# Altium schematic sheet WS3.0.SchDoc
size A4
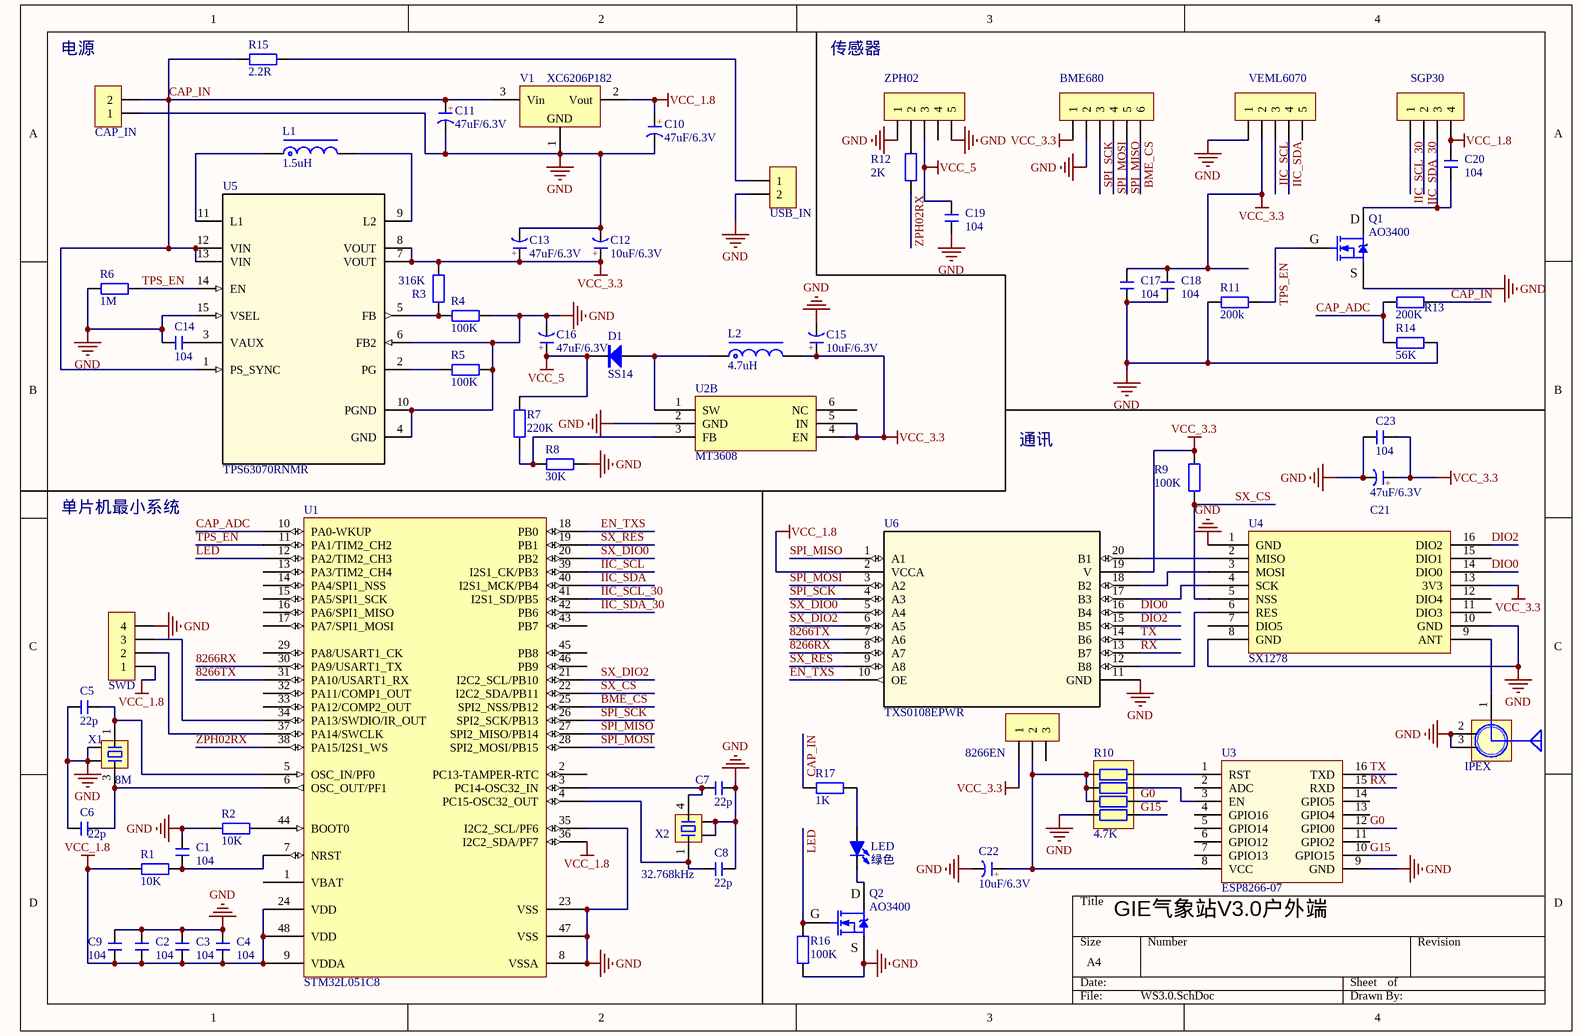
[diagram p0: WS3.0.SchDoc]

## Parts
8266EN  HDR-1X3  [HDR2.54-LI-3P]  (value not drawn)
?  IPEX  [IPEX]
BME680  HDR-1X6  [HDR2.54-LI-6P]  (value not drawn)
C1  104  [C 0603_L]
C2  104  [C 0603_L]
C3  104  [C 0603_L]
C4  104  [C 0603_L]
C5  22p  [C 0603_L]
C6  22p  [C 0603_L]
C7  22p  [C 0603_L]
C8  22p  [C 0603_L]
C9  104  [C 0603_L]
C10  47uF/6.3V  [CD A(3216)]
C11  47uF/6.3V  [CD A(3216)]
C12  10uF/6.3V  [CD S(2012)]
C13  47uF/6.3V  [CD A(3216)]
C14  104  [C 0603_L]
C15  10uF/6.3V  [CD S(2012)]
C16  47uF/6.3V  [CD A(3216)]
C17  104  [C 0603_L]
C18  104  [C 0603_L]
C19  104  [C 0603_L]
C20  104  [C 0603_L]
C21  47uF/6.3V  [CD A(3216)]
C22  10uF/6.3V  [CD S(2012)]
C23  104  [C 0603_L]
CAP_IN  HDR-1X2  [HDR2.54-LI-2P]  (value not drawn)
D1  SS14  [SOD-523]
L1  1.5uH  [NR4020]
L2  4.7uH  [L-SMD-0630]
LED  绿色  [LED 0805G]
Q1  AO3400  [SOT23-3N]
Q2  AO3400  [SOT23-3N]
R1  10K  [R 0603_L]
R2  10K  [R 0603_L]
R3  316K  [R 0603_L]
R4  100K  [R 0603_L]
R5  100K  [R 0603_L]
R6  1M  [R 0603_L]
R7  220K  [R 0603_L]
R8  30K  [R 0603_L]
R9  100K  [R 0603_L]
R10  4.7K  [RCA-8P4R-0603]
R11  200k  [R 0603_L]
R12  2K  [R 0603_L]
R13  200K  [R 0603_L]
R14  56K  [R 0603_L]
R15  2.2R  [RS 3W]
R16  100K  [R 0603_L]
R17  1K  [R 0603_L]
SGP30  HDR-1X4  [HDR2.54-LI-4P]  (value not drawn)
SWD  HDR-1X4  [HDR2.54-LI-4P]  (value not drawn)
U1  STM32L051C8  [LQFP48 7X7_M]
U2  MT3608  [SOT23-6L]  (part B of 2)
U3  ESP8266-07  [ESP-07]
U4  SX1278  [SX1278]
U5  TPS63070RNMR  [RNM0015A]
U6  TXS0108EPWR  [PW20]
USB_IN  HDR-1X2  [HDR2.54-LI-2P]  (value not drawn)
V1  XC6206P182  [SOT23-3M]
VEML6070  HDR-1X5  [HDR2.54-LI-5P]  (value not drawn)
X1  8M  [OSC 3225-4P]
X2  32.768kHz  [OSC MC-146]
ZPH02  HDR-1X5  [HDR2.54-LI-5P]  (value not drawn)

## Nets
GND: ?.2(GND) ?.3(GND) BME680.2 C1.2 C2.2 C3.2 C4.2 C5.1 C6.1 C7.2 C8.2 C9.2 C10.2(K) C11.2(K) C12.2(K) C13.2(K) C14.2 C15.2(K) C16.2(K) C17.1 C18.1 C19.1 C21.2(K) C22.2(K) C23.2 CAP_IN.1 Q1.2(S) Q2.2(S) R2.1 R4.2 R5.2 R6.1 R8.2 R10.4 R11.2 R14.1 R16.2 SWD.4 U1.8(VSSA) U1.23(VSS) U1.35(I2C2_SCL/PF6) U1.47(VSS) U2.2(GND) U3.9(GND) U4.1(GND) U4.8(GND) U4.10(GND) U5.4(GND) U5.6(FB2) U5.10(PGND) U5.15(VSEL) U6.11(GND) USB_IN.2 V1.1(GND) VEML6070.1 X1.2 X1.4 X2.2 X2.3 ZPH02.1 ZPH02.5
VCC_1.8: C2.1 C3.1 C4.1 C9.1 C10.1(A) C20.2 R1.1 SGP30.4 SWD.1 U1.9(VDDA) U1.24(VDD) U1.36(I2C2_SDA/PF7) U1.48(VDD) U6.2(VCCA) V1.2(Vout)
VCC_3.3: 8266EN.1 BME680.1 C12.1(A) C13.1(A) C15.1(A) C17.2 C18.2 C21.1(A) C23.1 L2.2 R3.2 R9.2 U2.4(EN) U2.5(IN) U4.13(3V3) U5.7(VOUT) U5.8(VOUT) U6.19(V) VEML6070.2
VCC_5: C16.1(A) C19.2 D1.2(K) R7.2 ZPH02.3
8266RX: U1.30(PA9/USART1_TX) U6.8(A7)
8266TX: U1.31(PA10/USART1_RX) U6.7(A6)
BME_CS: BME680.6 U1.25(SPI2_NSS/PB12)
CAP_ADC: R13.2 R14.2 U1.10(PA0-WKUP)
CAP_IN: C11.1(A) CAP_IN.2 R13.1 R15.1 R17.2 U5.1(PS_SYNC) U5.12(VIN) U5.13(VIN) V1.3(Vin)
DIO0: U4.14(DIO0) U6.16(B4)
DIO2: U4.16(DIO2) U6.15(B5)
EN_TXS: U1.18(PB0) U6.10(OE)
G0: R10.6 U3.12(GPIO0)
G15: R10.5 U3.10(GPIO15)
IIC_SCL: U1.39(I2S1_CK/PB3) VEML6070.3
IIC_SCL_30: SGP30.1 U1.41(I2S1_SD/PB5)
IIC_SDA: U1.40(I2S1_MCK/PB4) VEML6070.4
IIC_SDA_30: SGP30.2 U1.42(PB6)
LED: Q2.1(G) R16.1 U1.12(PA2/TIM2_CH3)
RX: U3.15(RXD) U6.13(B7)
SPI_MISO: BME680.5 U1.27(SPI2_MISO/PB14) U6.1(A1)
SPI_MOSI: BME680.4 U1.28(SPI2_MOSI/PB15) U6.3(A2)
SPI_SCK: BME680.3 U1.26(SPI2_SCK/PB13) U6.4(A3)
SX_CS: R9.1 U1.22(I2C2_SDA/PB11) U4.5(NSS)
SX_DIO0: U1.20(PB2) U6.5(A4)
SX_DIO2: U1.21(I2C2_SCL/PB10) U6.6(A5)
SX_RES: U1.19(PB1) U6.9(A8)
TPS_EN: Q1.1(G) R6.2 R11.1 U1.11(PA1/TIM2_CH2) U5.14(EN)
TX: U3.16(TXD) U6.14(B6)
ZPH02RX: R12.1 U1.38(PA15/I2S1_WS)
Net8266EN_2: 8266EN.2 C22.1(A) R10.1 R10.2 R10.3 U3.8(VCC)
Net?_1: ?.1(ANT) U4.9(ANT)
NetC1_1: C1.1 R1.2 U1.7(NRST)
NetC5_2: C5.2 U1.5(OSC_IN/PF0) X1.1
NetC6_2: C6.2 U1.6(OSC_OUT/PF1) X1.3
NetC7_1: C7.1 U1.3(PC14-OSC32_IN) X2.4
NetC8_1: C8.1 U1.4(PC15-OSC32_OUT) X2.1
NetC14_1: C14.1 U5.3(VAUX)
NetC20_1: C20.1 Q1.3(D) SGP30.3
NetD1_1: D1.1(A) L2.1 U2.1(SW)
NetL1_1: L1.1 U5.11(L1)
NetL1_2: L1.2 U5.9(L2)
NetLED_1: LED.1(A) R17.1
NetLED_2: LED.2(K) Q2.3(D)
NetR2_2: R2.2 U1.44(BOOT0)
NetR3_1: R3.1 R4.1 U5.5(FB)
NetR5_1: R5.1 U5.2(PG)
NetR7_1: R7.1 R8.1 U2.3(FB)
NetR10_7: R10.7 U3.3(EN)
NetR10_8: R10.8 U3.1(RST)
NetR12_2: R12.2 ZPH02.2
NetR15_2: R15.2 USB_IN.1
NetSWD_2: SWD.2 U1.37(PA14/SWCLK)
NetSWD_3: SWD.3 U1.34(PA13/SWDIO/IR_OUT)
NetU4_2: U4.2(MISO) U6.20(B1)
NetU4_3: U4.3(MOSI) U6.18(B2)
NetU4_4: U4.4(SCK) U6.17(B3)
NetU4_6: U4.6(RES) U6.12(B8)

Not connected (* = marked no-connect by the designer): 8266EN 3; U1 1(VBAT) 2(PC13-TAMPER-RTC) 13(PA3/TIM2_CH4) 14(PA4/SPI1_NSS) 15(PA5/SPI1_SCK) 16(PA6/SPI1_MISO) 17(PA7/SPI1_MOSI) 29(PA8/USART1_CK) 32(PA11/COMP1_OUT) 33(PA12/COMP2_OUT) 43(PB7) 45(PB8) 46(PB9); U2 6(NC); U3 2(ADC) 4(GPIO16) 5(GPIO14) 6(GPIO12) 7(GPIO13) 11(GPIO2) 13(GPIO4) 14(GPIO5); U4 7(DIO5) 11(DIO3) 12(DIO4) 15(DIO1); VEML6070 5; ZPH02 4

## Notes on the sheet
- 电源
- 传感器
- 通讯
- 单片机最小系统
- (near U3) GIE气象站V3.0户外端
- (in symbol C-CD) +

## Library data of the parts
8266EN = Header 3: 3P接插件; 版权归属: 源创客; BOM名称: 3P接插件; 学习资源: www.ooocke.com
? = SMA: SMA-2.4G射频天线接口; 版权归属: 源创客; BOM名称: SMA-2.4G射频天线接口; 学习资源: www.ooocke.com
BME680 = Header 6: 6P接插件; 版权归属: 源创客; BOM名称: 6P接插件; 学习资源: www.ooocke.com
C1-C9 C14 C17-C20 C23 = C: 无极性贴片电容; 版权归属: 源创客; BOM名称: 无极性贴片电容; 学习资源: www.ooocke.com
C10-C13 C15 C16 C21 C22 = C-CD: 贴片钽电容; 版权归属: 源创客; BOM名称: 贴片钽电容; 学习资源: www.ooocke.com
CAP_IN USB_IN = Header 2: 2P接插件; 版权归属: 源创客; BOM名称: 2P接插件; 学习资源: www.ooocke.com
D1 = SS14: 肖特基二极管; 版权归属: 源创客; 属性: 40V/1A; BOM名称: 肖特基二极管; 学习资源: www.ooocke.com
L1 L2 = L-NR: NR磁胶电感; 版权归属: 源创客; BOM名称: NR磁胶电感; 学习资源: www.ooocke.com
LED = LED-SMD: 贴片LED; 版权归属: 源创客; BOM名称: 贴片LED; 学习资源: www.ooocke.com
Q1 Q2 = SI2302: N沟道场效应管; 版权归属: 源创客; BOM名称: N沟道场效应管; 学习资源: www.ooocke.com
R1-R9 R11-R14 R16 R17 = R: 贴片电阻; 版权归属: 源创客; BOM名称: 贴片电阻; 学习资源: www.ooocke.com
R10 = R-8P4R: 贴片网络排阻; 版权归属: 源创客; BOM名称: 贴片网络排阻; 学习资源: www.ooocke.com
R15 = R-I: 电流检测电阻; 版权归属: 源创客; BOM名称: 电流检测电阻; 学习资源: www.ooocke.com
SGP30 SWD = Header 4: 4P接插件; 版权归属: 源创客; BOM名称: 4P接插件; 学习资源: www.ooocke.com
U1 = STM32F051C8: Flaah:64/RAM:20/IO:36; BOM名称: 32位STM单片机; 版权归属: 源创客; 学习资源: www.ooocke.com
U3 = ESP8266-07: 串口 WIFI模块，ESP-07; BOM名称: WIFI模块; 版权归属: 源创客; 学习资源: www.ooocke.com
U5 = TPS630701RNMR: No Description Available; Manufacturer: Texas Instruments; PartNumber: TPS63070RNMR; RefDes: RefDes; Type: DEV; Value: Value; Copyright: Copyright (C) 2018 Accelerated Designs. All rights reserved
U6 = TXS0108EPWR: 8-Bit Bidirectional Voltage-Level Translator For Open-Drain And Push-Pull Application; Vendor: Texas Instruments; PACKAGE_DESIGNATOR: PW; PIN_COUNT: 20; FAMILY_NAME: AUTO DIRECTION SENSING DUAL SUPPLY TRANSLATOR; INDUSTRY_STD_PKG_TYPE: TSSOP; Manufacturer_Part_Number: TXS0108EPWR; GENERIC_PART_NUMBER: TXS0108E; Datasheet_URL: http://www.ti.com/lit/gpn/TXS0108E; Manufacturer: Texas Instruments; Copyright: Copyright (C) 2018 Accelerated Designs. All rights reserved; RefDes: RefDes; Type: DEV
V1 = AMS1117: 三端稳压芯片; BOM名称: 稳压芯片; 版权归属: 源创客; 学习资源: www.ooocke.com
VEML6070 ZPH02 = Header 5: 5P接插件; 版权归属: 源创客; BOM名称: 5P接插件; 学习资源: www.ooocke.com
X1 = XTAL-4P: 4脚无源晶振; 版权归属: 源创客; BOM名称: 4脚无源晶振; 学习资源: www.ooocke.com
X2 = XTAL-MC-4P: MC系列4脚晶振; BOM名称: 2脚无源脚晶振; 版权归属: 源创客; 学习资源: www.ooocke.com